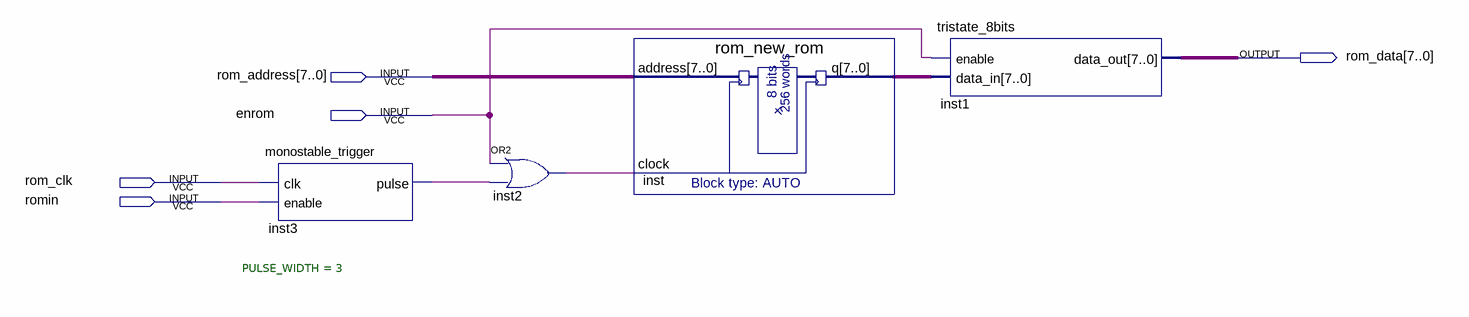
[diagram p0: schematic sheet]
// Quartus schematic rom_new.bdf as structural Verilog: 4 symbols, 5 pins
module rom_new (
  input  [7:0] rom_address,
  input  enrom,
  input  rom_clk,
  input  romin,
  output [7:0] rom_data
);

  wire inst2_out, inst3_pulse;
  wire [7:0] inst_q;

  monostable_trigger #(.PULSE_WIDTH(3)) inst3 (.clk(rom_clk), .enable(romin), .pulse(inst3_pulse));
  or inst2 (inst2_out, enrom, inst3_pulse);
  rom_new_rom inst (.address(rom_address), .clock(inst2_out), .q(inst_q));
  tristate_8bits inst1 (.enable(enrom), .data_in(inst_q), .data_out(rom_data));
endmodule
